# EAGLE design working (EAGLE 6.4)
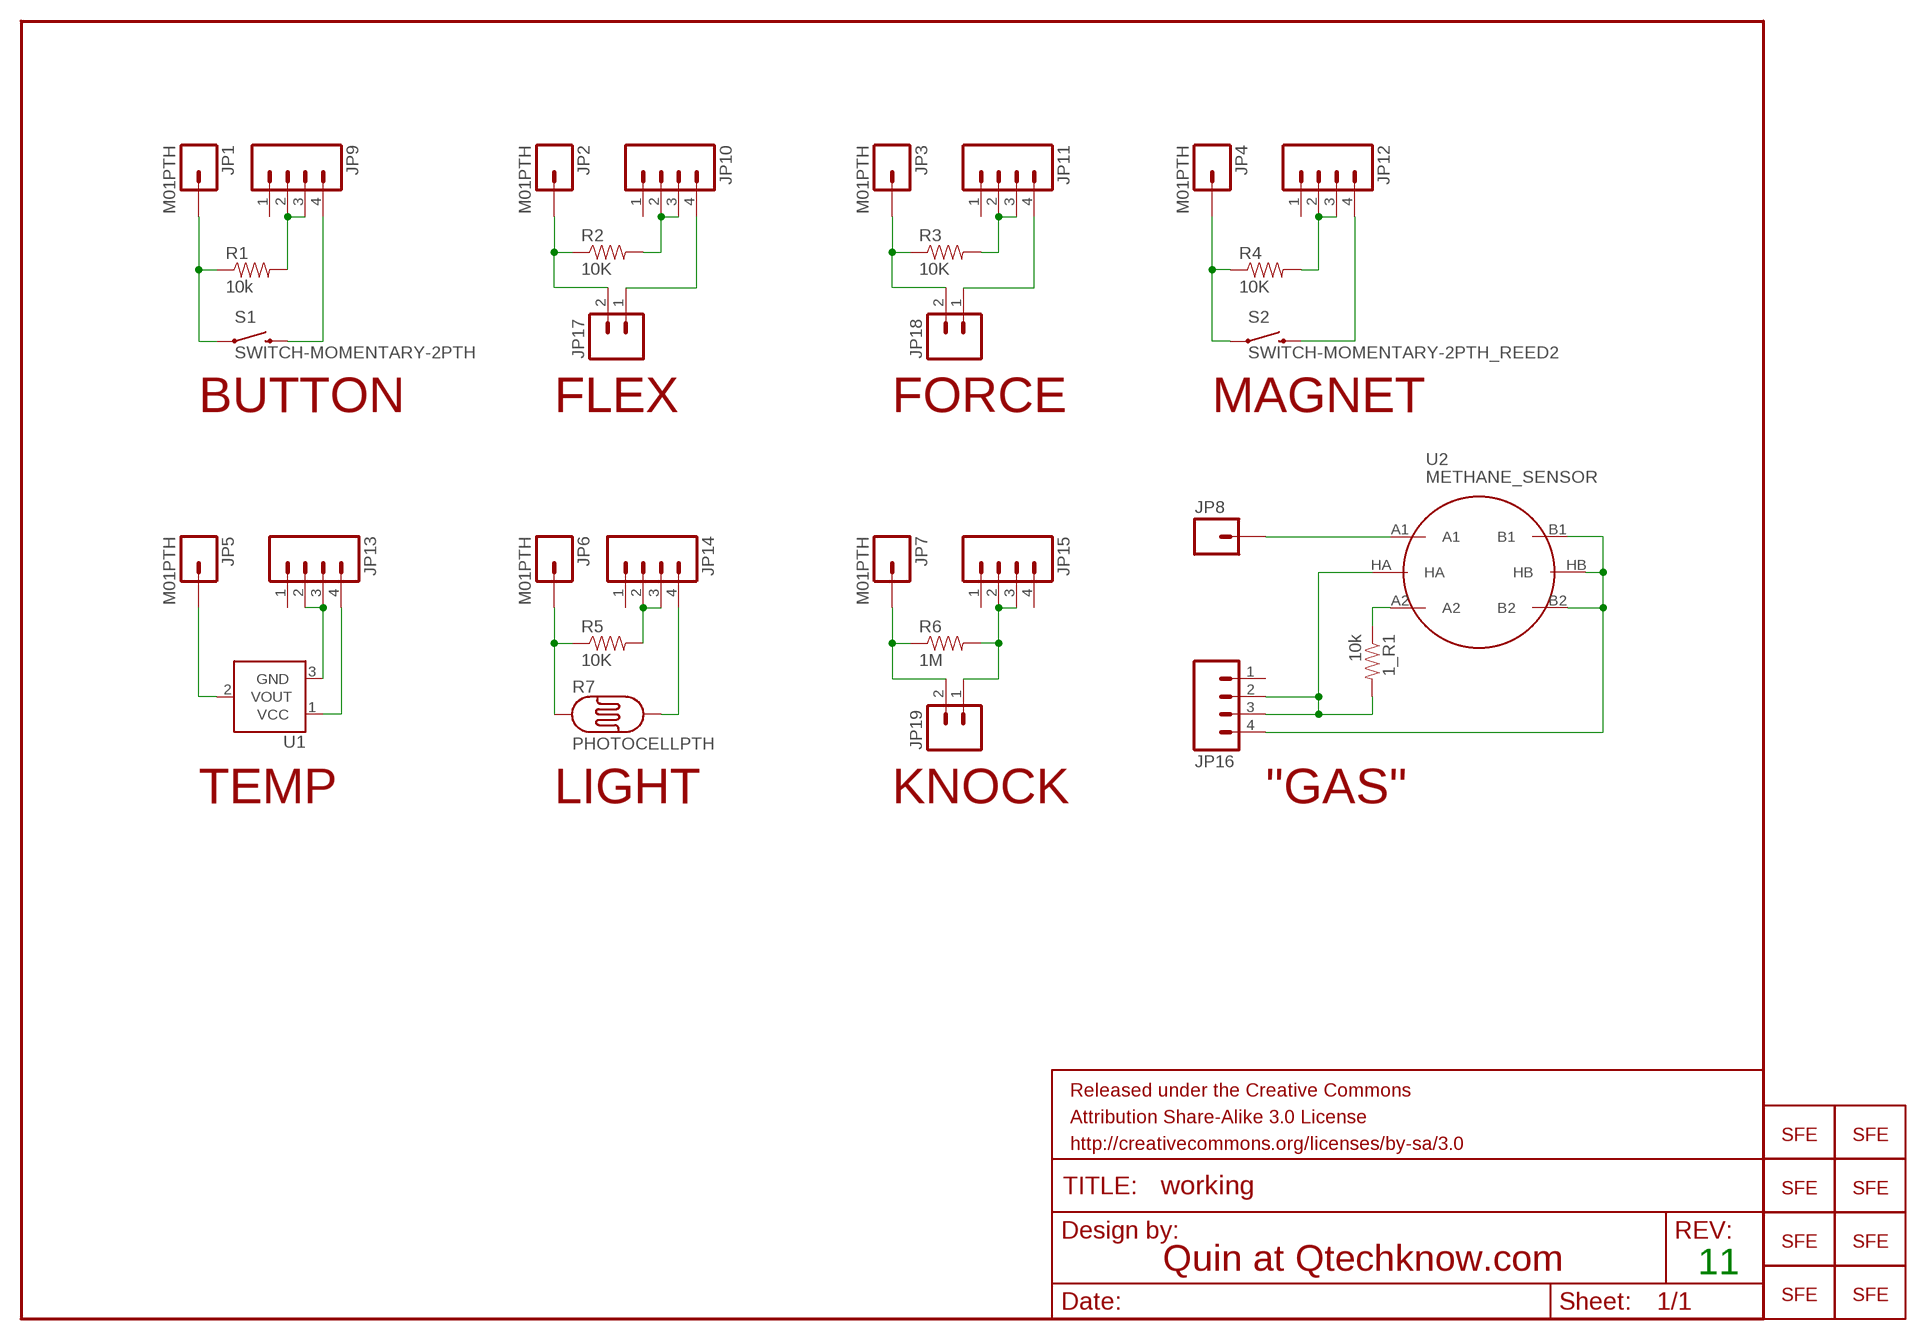
[diagram p0: schematic, sheet 1]

## Parts
1_R1  10k  RESISTORAXIAL-0.3  [AXIAL-0.3]
FRAME1  FRAME-LETTER  [CREATIVE_COMMONS]
JP1  M01PTH  [1X01]
JP2  M01PTH  [1X01]
JP3  M01PTH  [1X01]
JP4  M01PTH  [1X01]
JP5  M01PTH  [1X01]
JP6  M01PTH  [1X01]
JP7  M01PTH  [1X01]
JP8  M01PTH  [1X01]
JP9  M04PTH  [1X04]
JP10  M04PTH  [1X04]
JP11  M04PTH  [1X04]
JP12  M04PTH  [1X04]
JP13  M04PTH  [1X04]
JP14  M04PTH  [1X04]
JP15  M04PTH  [1X04]
JP16  M04PTH  [1X04]
JP17  M02PTH  [1X02]
JP18  M02PTH  [1X02]
JP19  M02PTH  [1X02]
LOGO1  LOGO-SFESK  [SFE-LOGO-FLAME]
LOGO2  LOGO-SFESK  [SFE-LOGO-FLAME]
LOGO3  LOGO-SFESK  [SFE-LOGO-FLAME]
LOGO4  LOGO-SFESK  [SFE-LOGO-FLAME]
LOGO5  LOGO-SFESK  [SFE-LOGO-FLAME]
LOGO6  LOGO-SFESK  [SFE-LOGO-FLAME]
LOGO7  LOGO-SFESK  [SFE-LOGO-FLAME]
LOGO8  LOGO-SFESK  [SFE-LOGO-FLAME]
R1  10k  RESISTORAXIAL-0.3  [AXIAL-0.3]
R2  10K  RESISTORAXIAL-0.3  [AXIAL-0.3]
R3  10K  RESISTORAXIAL-0.3  [AXIAL-0.3]
R4  10K  RESISTORAXIAL-0.3  [AXIAL-0.3]
R5  10K  RESISTORAXIAL-0.3  [AXIAL-0.3]
R6  1M  RESISTORAXIAL-0.3  [AXIAL-0.3]
R7  PHOTOCELLPTH  [PHOTOCELL]
S1  SWITCH-MOMENTARY-2PTH  [TACTILE-PTH]
S2  SWITCH-MOMENTARY-2PTH_REED2  [REED_SWITCH_PLASTIC]
U1  TMP36GT9  [TO-92]
U2  METHANE_SENSOR  [MQ-3]

## Nets
1_N$1: JP8.1 U2.A1
1_N$2: JP16.4 U2.B1 U2.B2 U2.HB
1_N$3: 1_R1.P$2 JP16.2 JP16.3 U2.HA
1_N$4: 1_R1.P$1 U2.A2
2_1_N$1: JP1.1 R1.P$1 S1.1
2_1_N$2: JP9.2 JP9.3 R1.P$2
2_1_N$3: JP9.4 S1.3
2_2_N$1: JP2.1 JP17.2 R2.P$1
2_2_N$2: JP10.2 JP10.3 R2.P$2
2_2_N$3: JP10.4 JP17.1
2_3_N$1: JP3.1 JP18.2 R3.P$1
2_3_N$2: JP11.2 JP11.3 R3.P$2
2_3_N$3: JP11.4 JP18.1
2_4_N$1: JP7.1 JP19.2 R6.P$1
2_4_N$2: JP15.2 JP15.3 JP19.1 R6.P$2
2_5_N$1: JP6.1 R5.P$1 R7.1
2_5_N$2: JP14.2 JP14.3 R5.P$2
2_5_N$3: JP14.4 R7.2
2_6_N$1: JP4.1 R4.P$1 S2.P$1
2_6_N$2: JP12.2 JP12.3 R4.P$2
2_6_N$3: JP12.4 S2.P$2
2_7_N$1: JP5.1 U1.2(VOUT)
2_7_N$2: JP13.2 JP13.3 U1.3(GND)
2_7_N$3: JP13.4 U1.1(VCC)
Unconnected: JP9.1 JP10.1 JP11.1 JP12.1 JP13.1 JP14.1 JP15.1 JP15.4 JP16.1

## Notes on the sheet
- BUTTON | FLEX | FORCE | MAGNET
- TEMP | LIGHT | KNOCK | "GAS"
- Quin at Qtechknow.com | 11

## Library data of the parts
1_R1 = 1_SparkFun-Passives:RESISTOR: Resistor Basic schematic elements and footprints for 0603, 1206, and PTH resistors.
FRAME1 = SparkFun-Aesthetics:FRAME-LETTER: Schematic Frame Standard 8.5x11 US Letter frame
JP1 = 2_1_SFE Connectors:M01: Header 1 Standard 1-pin 0.1" header. Use with straight break away headers (SKU : PRT-00116), right angle break away headers (PRT-00553), swiss pins (PRT-00743), machine pins (PRT-00117), and female headers (PRT-00115).
JP2 = 2_2_SFE Connectors:M01: Header 1 Standard 1-pin 0.1" header. Use with straight break away headers (SKU : PRT-00116), right angle break away headers (PRT-00553), swiss pins (PRT-00743), machine pins (PRT-00117), and female headers (PRT-00115).
JP3 = 2_3_SFE Connectors:M01: Header 1 Standard 1-pin 0.1" header. Use with straight break away headers (SKU : PRT-00116), right angle break away headers (PRT-00553), swiss pins (PRT-00743), machine pins (PRT-00117), and female headers (PRT-00115).
JP4 = 2_6_SFE Connectors:M01: Header 1 Standard 1-pin 0.1" header. Use with straight break away headers (SKU : PRT-00116), right angle break away headers (PRT-00553), swiss pins (PRT-00743), machine pins (PRT-00117), and female headers (PRT-00115).
JP5 = 2_7_SFE Connectors:M01: Header 1 Standard 1-pin 0.1" header. Use with straight break away headers (SKU : PRT-00116), right angle break away headers (PRT-00553), swiss pins (PRT-00743), machine pins (PRT-00117), and female headers (PRT-00115).
JP6 = 2_5_SFE Connectors:M01: Header 1 Standard 1-pin 0.1" header. Use with straight break away headers (SKU : PRT-00116), right angle break away headers (PRT-00553), swiss pins (PRT-00743), machine pins (PRT-00117), and female headers (PRT-00115).
JP7 = 2_4_SFE Connectors:M01: Header 1 Standard 1-pin 0.1" header. Use with straight break away headers (SKU : PRT-00116), right angle break away headers (PRT-00553), swiss pins (PRT-00743), machine pins (PRT-00117), and female headers (PRT-00115).
JP8 = 1_SparkFun-Connectors:M01: Header 1 Standard 1-pin 0.1" header. Use with straight break away headers (SKU : PRT-00116), right angle break away headers (PRT-00553), swiss pins (PRT-00743), machine pins (PRT-00117), and female headers (PRT-00115).
JP9 = 2_1_SFE Connectors:M04: Header 4 Standard 4-pin 0.1" header. Use with straight break away headers (SKU : PRT-00116), right angle break away headers (PRT-00553), swiss pins (PRT-00743), machine pins (PRT-00117), and female headers (PRT-00115). Molex polarized connector foot print use with SKU : PRT-08231 with associated crimp pins and housings. 1MM SMD Version SKU: PRT-10208
JP10 = 2_2_SFE Connectors:M04: Header 4 Standard 4-pin 0.1" header. Use with straight break away headers (SKU : PRT-00116), right angle break away headers (PRT-00553), swiss pins (PRT-00743), machine pins (PRT-00117), and female headers (PRT-00115). Molex polarized connector foot print use with SKU : PRT-08231 with associated crimp pins and housings. 1MM SMD Version SKU: PRT-10208
JP11 = 2_3_SFE Connectors:M04: Header 4 Standard 4-pin 0.1" header. Use with straight break away headers (SKU : PRT-00116), right angle break away headers (PRT-00553), swiss pins (PRT-00743), machine pins (PRT-00117), and female headers (PRT-00115). Molex polarized connector foot print use with SKU : PRT-08231 with associated crimp pins and housings. 1MM SMD Version SKU: PRT-10208
JP12 = 2_6_SFE Connectors:M04: Header 4 Standard 4-pin 0.1" header. Use with straight break away headers (SKU : PRT-00116), right angle break away headers (PRT-00553), swiss pins (PRT-00743), machine pins (PRT-00117), and female headers (PRT-00115). Molex polarized connector foot print use with SKU : PRT-08231 with associated crimp pins and housings. 1MM SMD Version SKU: PRT-10208
JP13 = 2_7_SFE Connectors:M04: Header 4 Standard 4-pin 0.1" header. Use with straight break away headers (SKU : PRT-00116), right angle break away headers (PRT-00553), swiss pins (PRT-00743), machine pins (PRT-00117), and female headers (PRT-00115). Molex polarized connector foot print use with SKU : PRT-08231 with associated crimp pins and housings. 1MM SMD Version SKU: PRT-10208
JP14 = 2_5_SFE Connectors:M04: Header 4 Standard 4-pin 0.1" header. Use with straight break away headers (SKU : PRT-00116), right angle break away headers (PRT-00553), swiss pins (PRT-00743), machine pins (PRT-00117), and female headers (PRT-00115). Molex polarized connector foot print use with SKU : PRT-08231 with associated crimp pins and housings. 1MM SMD Version SKU: PRT-10208
JP15 = 2_4_SFE Connectors:M04: Header 4 Standard 4-pin 0.1" header. Use with straight break away headers (SKU : PRT-00116), right angle break away headers (PRT-00553), swiss pins (PRT-00743), machine pins (PRT-00117), and female headers (PRT-00115). Molex polarized connector foot print use with SKU : PRT-08231 with associated crimp pins and housings. 1MM SMD Version SKU: PRT-10208
JP16 = 1_SparkFun-Connectors:M04: Header 4 Standard 4-pin 0.1" header. Use with straight break away headers (SKU : PRT-00116), right angle break away headers (PRT-00553), swiss pins (PRT-00743), machine pins (PRT-00117), and female headers (PRT-00115). Molex polarized connector foot print use with SKU : PRT-08231 with associated crimp pins and housings. 1MM SMD Version SKU: PRT-10208
JP17 = 2_2_SFE Connectors:M02: Header 2 Standard 2-pin 0.1" header. Use with straight break away headers (SKU : PRT-00116), right angle break away headers (PRT-00553), swiss pins (PRT-00743), machine pins (PRT-00117), and female headers (PRT-00115). Molex polarized connector foot print use with SKU : PRT-08233 with associated crimp pins and housings.
JP18 = 2_3_SFE Connectors:M02: Header 2 Standard 2-pin 0.1" header. Use with straight break away headers (SKU : PRT-00116), right angle break away headers (PRT-00553), swiss pins (PRT-00743), machine pins (PRT-00117), and female headers (PRT-00115). Molex polarized connector foot print use with SKU : PRT-08233 with associated crimp pins and housings.
JP19 = 2_4_SFE Connectors:M02: Header 2 Standard 2-pin 0.1" header. Use with straight break away headers (SKU : PRT-00116), right angle break away headers (PRT-00553), swiss pins (PRT-00743), machine pins (PRT-00117), and female headers (PRT-00115). Molex polarized connector foot print use with SKU : PRT-08233 with associated crimp pins and housings.
LOGO1-LOGO8 = SparkFun-Aesthetics:LOGO-SFE: Spark Fun Electronics PCB Logo This is the standard Spark Fun Electronics PCB logo.
R1 = 2_1_SFE Passives:RESISTOR: Resistor Basic schematic elements and footprints for 0603, 1206, and PTH resistors.
R2 = 2_2_SFE Passives:RESISTOR: Resistor Basic schematic elements and footprints for 0603, 1206, and PTH resistors.
R3 = 2_3_SFE Passives:RESISTOR: Resistor Basic schematic elements and footprints for 0603, 1206, and PTH resistors.
R4 = 2_6_SFE Passives:RESISTOR: Resistor Basic schematic elements and footprints for 0603, 1206, and PTH resistors.
R5 = 2_5_SFE Passives:RESISTOR: Resistor Basic schematic elements and footprints for 0603, 1206, and PTH resistors.
R6 = 2_4_SFE Passives:RESISTOR: Resistor Basic schematic elements and footprints for 0603, 1206, and PTH resistors.
R7 = 2_5_SFE Sensors:PHOTOCELL: CdS photoresistor. This is a low cost way to detect light levels. Resistance decreases with more incoming light. SparkFun SKU: SEN-09088
S1 = 2_1_SFE Electromechanical:SWITCH-MOMENTARY-2: Various NO switches- pushbuttons, reed, etc
S2 = 2_6_SFE Electromechanical:SWITCH-MOMENTARY-2: Various NO switches- pushbuttons, reed, etc
U1 = 2_7_SFE Sensors:TMP36: Precision degC temp sensor, analog out
U2 = 1_SparkFun-Sensors:METHANE_SENSOR: MQ-4 Methane Gas Sensor SEN-09404

## Board
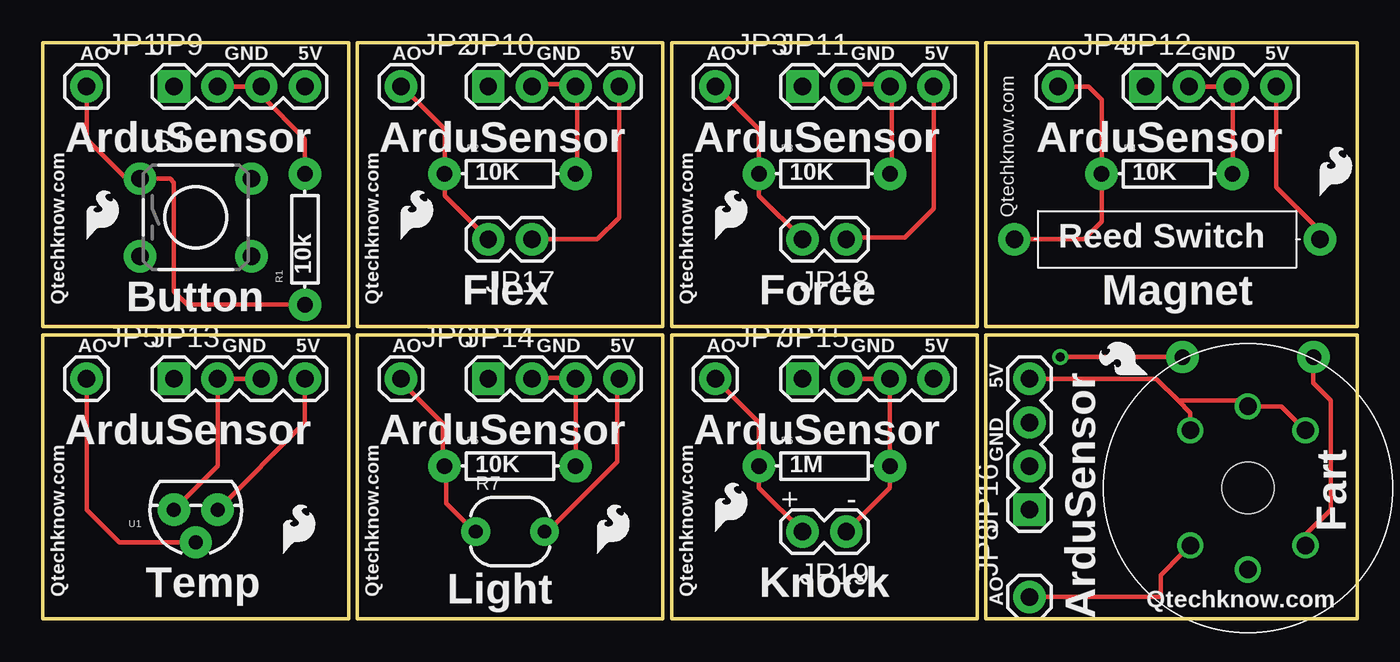
[diagram p1: board, top side]
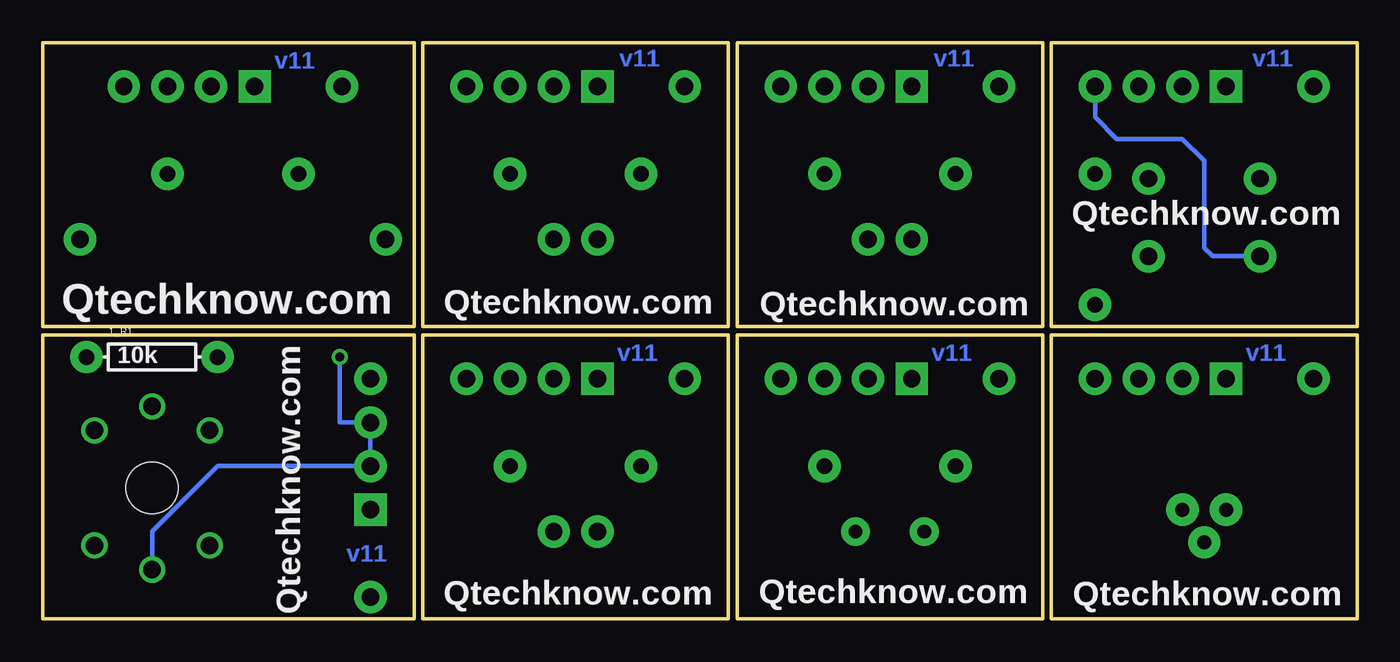
[diagram p2: board, bottom side, seen from below]

Size 76.45 x 33.53 mm. Coordinates in mm from the lower left corner, seen from the top.
Outline: 17.78,33.53 0,33.53 0,17.02 17.78,17.02 17.78,33.53
Outline: 36.07,33.53 18.29,33.53 18.29,17.02 36.07,17.02 36.07,33.53
Outline: 54.36,33.53 36.58,33.53 36.58,17.02 54.36,17.02 54.36,33.53
Outline: 36.58,0 54.36,0 54.36,16.51 36.58,16.51 36.58,0
Outline: 54.86,0 54.86,16.51 76.45,16.51 76.45,0 54.86,0
Outline: 36.07,16.51 36.07,0 18.29,0 18.29,16.51 36.07,16.51
Outline: 54.86,17.02 76.45,17.02 76.45,33.53 54.86,33.53 54.86,17.02
Outline: 0,0 17.78,0 17.78,16.51 0,16.51 0,0
Copper layers (1*16): Top 0.035mm / dielectric 1.5mm / Bottom 0.035mm
Design rules "default": minimum track width 10mil, minimum drill 24mil, track to track 8mil, track to pad 8mil, pad to pad 8mil, via to via 8mil, smd to smd 8mil, copper to edge 40mil, drill to drill 8mil, minimum pad ring 10mil, minimum via ring 8mil, stop-mask expansion 4mil, vias tented up to drill 0mil, thermal gap 10mil

### Footprints (pad centres in the part's own frame; a part is rotated, then mirrored left to right if it is on the bottom)
AXIAL-0.3 = drill 0.9 pad 1.88: P$1 -3.81,0; P$2 3.81,0
1X01 = drill 1.016 pad 1.88: 1 0,0
1X04 = drill 1.016 pad 1.88 square: 1 0,0 | drill 1.016 pad 1.88: 2 2.54,0; 3 5.08,0; 4 7.62,0
1X02 = drill 1.016 pad 1.88: 1 0,0; 2 2.54,0
PHOTOCELL = drill 0.8 pad 1.676: 1 -2,0; 2 2,0
TACTILE-PTH = drill 1.016 pad 1.88: 1 -3.251,2.261; 2 3.251,2.261; 3 -3.251,-2.261; 4 3.251,-2.261
REED_SWITCH_PLASTIC = drill 1.016 pad 1.88: P$1 -8.89,0; P$2 8.89,0
TO-92 = drill 0.813 pad 1.88: 1 -1.27,0; 2 0,1.905; 3 1.27,0
MQ-3 = drill 1.016: A1 -3.35,3.35; A2 -3.35,-3.35; B1 3.35,3.35; B2 3.35,-3.35; HA -4.75,0; HB 4.75,0 | hole 3: 0,0

### Placement (x,y rotation side)
1_R1  70.1,15.24 0 bottom
FRAME1  20.32,-8.89 0 top  (outside the outline)
JP1  2.54,30.99 0 top
JP2  20.83,30.99 0 top
JP3  39.12,30.99 0 top
JP4  59.05,30.99 0 top
JP5  2.54,13.97 0 top
JP6  20.83,13.97 0 top
JP7  39.12,13.97 0 top
JP8  57.4,1.27 90 top
JP9  7.62,30.99 0 top
JP10  25.91,30.99 0 top
JP11  44.2,30.99 0 top
JP12  64.14,30.99 0 top
JP13  7.62,13.97 0 top
JP14  25.91,13.97 0 top
JP15  44.2,13.97 0 top
JP16  57.4,6.35 90 top
JP17  28.45,22.1 180 top
JP18  46.74,22.1 180 top
JP19  46.74,5.08 180 top
LOGO1  2.54,22.1 0 top
LOGO2  64.26,14.22 90 top
LOGO3  74.3,24.64 0 top
LOGO4  39.12,5.08 0 top
LOGO5  39.12,22.1 0 top
LOGO6  20.83,22.1 0 top
LOGO7  32.26,3.81 0 top
LOGO8  13.97,3.81 0 top
R1  15.24,22.1 90 top
R2  27.18,25.91 0 top
R3  45.47,25.91 0 top
R4  65.41,25.91 0 top
R5  27.18,8.89 0 top
R6  45.47,8.89 0 top
R7  27.18,5.08 0 top
S1  8.89,23.37 0 top
S2  65.41,22.1 0 top
U1  8.89,6.35 180 top
U2  70.1,7.62 90 top

### Tracks (layer width: path | path; a pad name or v marks a point on that pad's centre or on a via)
1_N$1
  Top 0.203: 66.29,3.81 U2.A1
  Top 0.254: JP8.1 65.02,1.27 65.02,2.54 66.29,3.81
1_N$2
  Top 0.254: JP16.4 64.77,13.97 66.04,12.7 | 66.04,12.7 69.77,12.7 U2.HB 72.05,12.37 U2.B2 | U2.B1 66.75,11.99 66.04,12.7
1_N$3  (via drill 0.51)
  Top 0.254: 1_R1.P$2 v59.18,15.24
  Bottom 0.254: v59.18,15.24 59.18,11.43 JP16.3 JP16.2 66.29,8.89 70.1,5.08 U2.HA
1_N$4
  Top 0.254: 1_R1.P$1 73.91,13.72 74.93,12.7 74.93,6.35 73.45,4.87 U2.A2
2_1_N$1
  Top 0.254: JP1.1 2.54,27.94 4.85,25.63 S1.1 7.39,25.63 7.62,25.4 7.62,19.05 8.38,18.29 R1.P$1
2_1_N$2
  Top 0.254: R1.P$2 15.24,27.94 12.7,30.48 JP9.3 JP9.2
2_1_N$3
  Bottom 0.254: JP9.4 15.24,29.21 13.97,27.94 10.16,27.94 8.89,26.67 8.89,21.59 8.41,21.11 S1.3
2_2_N$1
  Top 0.254: JP17.2 23.37,24.64 R2.P$1 23.37,28.5 20.93,30.94 JP2.1
2_2_N$2
  Top 0.254: JP10.2 28.45,31.14 30.89,31.14 JP10.3 31.09,30.94 31.09,26.06 R2.P$2
2_2_N$3
  Top 0.254: JP17.1 32.26,22.1 33.53,23.37 JP10.4
2_3_N$1
  Top 0.254: JP18.2 41.66,24.64 R3.P$1 41.66,28.5 39.22,30.94 JP3.1
2_3_N$2
  Top 0.254: JP11.2 46.74,31.14 49.17,31.14 JP11.3 49.38,30.94 49.38,26.06 R3.P$2
2_3_N$3
  Top 0.254: JP18.1 46.74,22.2 50.14,22.2 51.82,23.88 JP11.4
2_4_N$1
  Top 0.254: JP19.2 41.66,7.62 R6.P$1 41.66,11.43 JP7.1
2_4_N$2
  Top 0.254: JP15.2 JP15.3 R6.P$2 49.28,7.62 JP19.1
2_5_N$1
  Top 0.254: R7.1 25.09,5.08 23.47,6.71 23.47,8.74 R5.P$1 23.27,8.94 23.27,11.38 20.83,13.82 JP6.1
2_5_N$2
  Top 0.254: JP14.2 28.55,14.02 30.99,14.02 JP14.3 R5.P$2
2_5_N$3
  Top 0.254: R7.2 29.36,5.08 33.43,9.14 33.43,13.82 JP14.4
2_6_N$1
  Top 0.254: JP4.1 60.83,30.99 61.59,30.23 R4.P$1 61.59,23.11 60.58,22.1 S2.P$1
2_6_N$2
  Top 0.254: JP12.2 JP12.3 R4.P$2
2_6_N$3
  Top 0.254: JP12.4 71.75,25.15 74.3,22.61 S2.P$2
2_7_N$1
  Top 0.254: JP5.1 2.54,6.35 4.45,4.45 U1.2
2_7_N$2
  Top 0.254: U1.3 10.16,8.89 JP13.2 JP13.3
2_7_N$3
  Top 0.254: U1.1 15.24,11.43 JP13.4

### Text on the board
Bottom: v11 | v11 | v11 | v11 | v11 | v11 | v11 | v11
tPlace: AO | GND | 5V | AO | GND | 5V | AO | GND | 5V | AO | GND | 5V | ArduSensor | ArduSensor | ArduSensor | ArduSensor | Qtechknow.com | Reed Switch | Qtechknow.com | Button | Qtechknow.com | Flex | Qtechknow.com | Force | Magnet | AO | GND | 5V | AO | GND | 5V | AO | GND | 5V | 5V | ArduSensor | ArduSensor | ArduSensor | GND | + | - | Fart | Qtechknow.com | Qtechknow.com | Temp | Qtechknow.com | Light | Qtechknow.com | Knock | AO | ArduSensor
bPlace: Qtechknow.com | Qtechknow.com | Qtechknow.com | Qtechknow.com | Qtechknow.com | Qtechknow.com | Qtechknow.com | Qtechknow.com
tNames: Quin at Qtechknow